# Altium schematic sheet L2_PCB.schdoc
size 309 x 197 mm
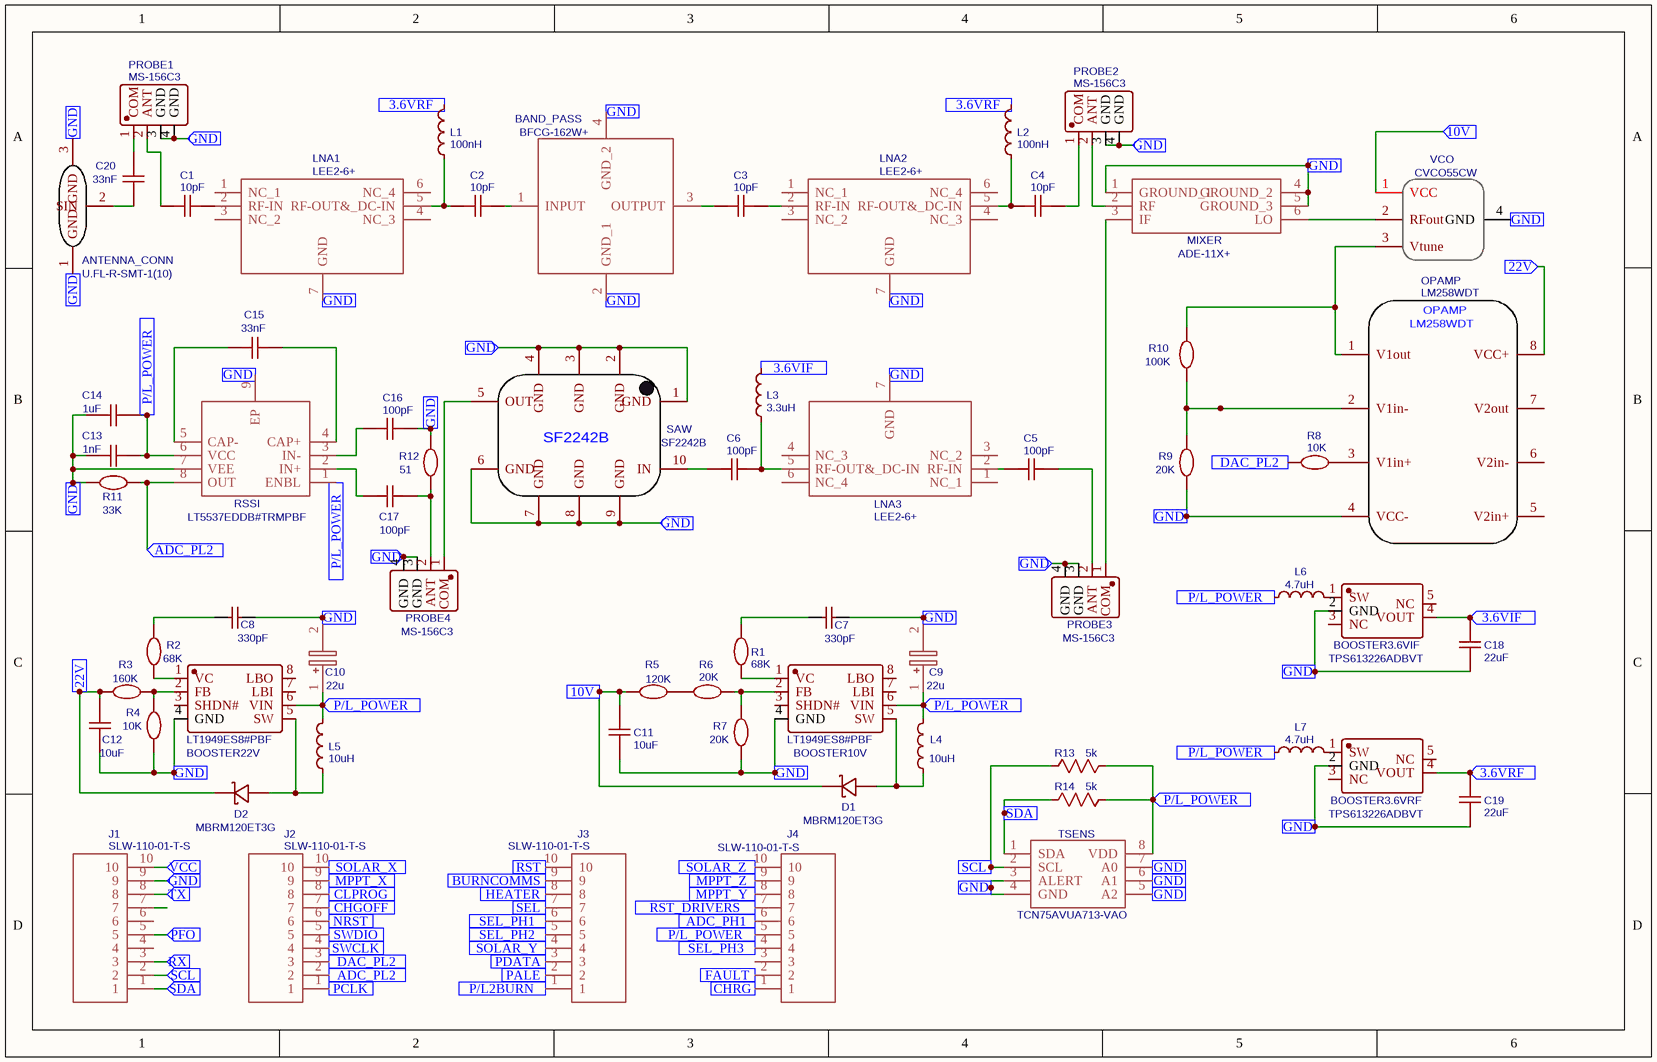
[diagram p0: L2_PCB.schdoc]

## Parts
ANTENNA_CONN  U.FL-R-SMT-1(10)  [ANT-SMD_UFL-R-SMT-1-10]
BAND_PASS  BFCG-162W+  [BFCG162W]
BOOSTER3.6VIF  TPS613226ADBVT  [SOT-23-5_L2.9-W1.6-P0.95-LS2.8-BR]
BOOSTER3.6VRF  TPS613226ADBVT  [SOT-23-5_L2.9-W1.6-P0.95-LS2.8-BR]
BOOSTER10V  LT1949ES8#PBF  [SO-8_L4.9-W3.9-P1.27-LS5.9-BL]
BOOSTER22V  LT1949ES8#PBF  [SO-8_L4.9-W3.9-P1.27-LS5.9-BL]
C1  10pF  [C0603]
C2  10pF  [C0603]
C3  10pF  [C0603]
C4  10pF  [C0603]
C5  100pF  [C0603]
C6  100pF  [C0603]
C7  330pF  [C0603]
C8  330pF  [C0603]
C9  22u  [CAPPM3216X180N]
C10  22u  [CAPPM3216X180N]
C11  10uF  [C0603]
C12  10uF  [C0603]
C13  1nF  [C0603]
C14  1uF  [C0603]
C15  33nF  [C0603]
C16  100pF  [C0603]
C17  100pF  [C0603]
C18  22uF  [C0603]
C19  22uF  [C0603]
C20  33nF  [C0603]
D1  MBRM120ET3G  [POWERMITE_L2.0-W1.9-LS3.8-RD]
D2  MBRM120ET3G  [POWERMITE_L2.0-W1.9-LS3.8-RD]
J1  SLW-110-01-T-S  [SLW-110-01-X-S]
J2  SLW-110-01-T-S  [SLW-110-01-X-S]
J3  SLW-110-01-T-S  [SLW-110-01-X-S]
J4  SLW-110-01-T-S  [SLW-110-01-X-S]
L1  100nH  [L0402]
L2  100nH  [L0402]
L3  3.3uH  [L0603]
L4  10uH  [L0603]
L5  10uH  [L0603]
L6  4.7uH  [L0805]
L7  4.7uH  [L0805]
LNA1  LEE2-6+  [SON65P200X200X105-7N]
LNA2  LEE2-6+  [SON65P200X200X105-7N]
LNA3  LEE2-6+  [SON65P200X200X105-7N]
MIXER  ADE-11X+  [SOTFL254P691X284-6N]
OPAMP  LM258WDT  [SO8]
PROBE1  MS-156C3  [IPEX-SMD_MS-156C3]
PROBE2  MS-156C3  [IPEX-SMD_MS-156C3]
PROBE3  MS-156C3  [IPEX-SMD_MS-156C3]
PROBE4  MS-156C3  [IPEX-SMD_MS-156C3]
R1  68K  [R0603]
R2  68K  [R0603]
R3  160K  [R0603]
R4  10K  [R0603]
R5  120K  [R0603]
R6  20K  [R0603]
R7  20K  [R0603]
R8  10K  [R0603]
R9  20K  [R0603]
R10  100K  [R0603]
R11  33K  [R0603]
R12  51  [R0603]
R13  5k  [R0805]
R14  5k  [R0805]
RSSI  LT5537EDDB#TRMPBF  [SON50P200X300X80-9N]
SAW  SF2242B  [SMP-03-10 5X7 MM]
TSENS  TCN75AVUA713-VAO  [SOP65P490X110-8N]
VCO  CVCO55CW  [CVCO55CW]

## Ports
3.6VIF (in), 3.6VRF (in), 10V (in), 22V (in), ADC_PH1 (in), ADC_PL2 (in), BURNCOMMS (in), CHGOFF (in), CHRG (in), CLPROG (in), DAC_PL2 (in), FAULT (in), GND (in), HEATER (in), MPPT_X (in), MPPT_Y (in), MPPT_Z (in), NRST (in), P/L2BURN (in), P/L_POWER (in), PALE (in), PCLK (in), PDATA (in), PFO (in), RST (in), RST_DRIVERS (in), RX (in), SCL (in), SDA (in), SEL (in), SEL_PH1 (in), SEL_PH2 (in), SEL_PH3 (in), SOLAR_X (in), SOLAR_Y (in), SOLAR_Z (in), SWCLK (in), SWDIO (in), TX (in), VCC (in)

## Nets
3.6VIF: BOOSTER3.6VIF.4(VOUT) C18.2 L3.2 ; port 3.6VIF
3.6VRF: BOOSTER3.6VRF.4(VOUT) C19.2 L1.2 L2.2 ; port 3.6VRF
10V: C11.2 D1.1(C) R5.1 VCO.1(VCC) ; port 10V
22V: C12.2 D2.1(C) OPAMP.8(VCC+) R3.1 ; port 22V
ADC_PH1: J4.6 ; port ADC_PH1
ADC_PL2: J2.2 R11.1 RSSI.8(OUT) ; port ADC_PL2
BURNCOMMS: J3.9 ; port BURNCOMMS
CHGOFF: J2.7 ; port CHGOFF
CHRG: J4.1 ; port CHRG
CLPROG: J2.8 ; port CLPROG
DAC_PL2: J2.3 R8.2 ; port DAC_PL2
FAULT: J4.2 ; port FAULT
GND: ANTENNA_CONN.1(GND) ANTENNA_CONN.3(GND) BAND_PASS.2(GND_1) BAND_PASS.4(GND_2) BOOSTER3.6VIF.2(GND) BOOSTER3.6VRF.2(GND) BOOSTER10V.4(GND) BOOSTER22V.4(GND) C7.2 C8.1 C9.2(-) C10.2(-) C11.1 C12.1 C13.2 C14.2 C16.2 C18.1 C19.1 J1.9 LNA1.7(GND) LNA2.7(GND) LNA3.7(GND) MIXER.1(GROUND_1) MIXER.4(GROUND_2) MIXER.5(GROUND_3) OPAMP.4(VCC-) PROBE1.3(GND) PROBE1.4(GND) PROBE2.3(GND) PROBE2.4(GND) PROBE3.3(GND) PROBE3.4(GND) PROBE4.3(GND) PROBE4.4(GND) R4.1 R7.1 R9.2 R11.2 R12.1 RSSI.7(VEE) RSSI.9(EP) SAW.1(GND) SAW.2(GND) SAW.3(GND) SAW.4(GND) SAW.6(GND) SAW.7(GND) SAW.8(GND) SAW.9(GND) TSENS.3(ALERT) TSENS.4(GND) TSENS.5(A2) TSENS.6(A1) TSENS.7(A0) VCO.4(GND) ; port GND
HEATER: J3.8 ; port HEATER
MPPT_X: J2.9 ; port MPPT_X
MPPT_Y: J4.8 ; port MPPT_Y
MPPT_Z: J4.9 ; port MPPT_Z
NRST: J2.6 ; port NRST
P/L2BURN: J3.1 ; port P/L2BURN
P/L_POWER: BOOSTER10V.6(VIN) BOOSTER22V.6(VIN) C9.1(+) C10.1(+) C13.1 C14.1 J4.5 L4.2 L5.2 L6.1 L7.1 R13.2 R14.2 RSSI.1(ENBL) RSSI.6(VCC) TSENS.8(VDD) ; port P/L_POWER
PALE: J3.2 ; port PALE
PCLK: J2.1 ; port PCLK
PDATA: J3.3 ; port PDATA
PFO: J1.5 ; port PFO
RST: J3.10 ; port RST
RST_DRIVERS: J4.7 ; port RST_DRIVERS
RX: J1.3 ; port RX
SCL: J1.2 R13.1 TSENS.2(SCL) ; port SCL
SDA: J1.1 R14.1 TSENS.1(SDA) ; port SDA
SEL: J3.7 ; port SEL
SEL_PH1: J3.6 ; port SEL_PH1
SEL_PH2: J3.5 ; port SEL_PH2
SEL_PH3: J4.4 ; port SEL_PH3
SOLAR_X: J2.10 ; port SOLAR_X
SOLAR_Y: J3.4 ; port SOLAR_Y
SOLAR_Z: J4.10 ; port SOLAR_Z
SWCLK: J2.4 ; port SWCLK
SWDIO: J2.5 ; port SWDIO
TX: J1.8 ; port TX
VCC: J1.10 ; port VCC
NetANTENNA_CONN_2: ANTENNA_CONN.2(SIN) C20.2
NetBAND_PASS_1: BAND_PASS.1(INPUT) C2.2
NetBAND_PASS_3: BAND_PASS.3(OUTPUT) C3.1
NetBOOSTER3.6VIF_1: BOOSTER3.6VIF.1(SW) L6.2
NetBOOSTER3.6VRF_1: BOOSTER3.6VRF.1(SW) L7.2
NetBOOSTER10V_1: BOOSTER10V.1(VC) R1.1
NetBOOSTER10V_2: BOOSTER10V.2(FB) R6.2 R7.2
NetBOOSTER10V_5: BOOSTER10V.5(SW) D1.2(A) L4.1
NetBOOSTER22V_1: BOOSTER22V.1(VC) R2.2
NetBOOSTER22V_2: BOOSTER22V.2(FB) R3.2 R4.2
NetBOOSTER22V_5: BOOSTER22V.5(SW) D2.2(A) L5.1
NetC1_1: C1.1 PROBE1.2(ANT)
NetC1_2: C1.2 LNA1.2(RF-IN)
NetC2_1: C2.1 L1.1 LNA1.5(RF-OUT&_DC-IN)
NetC3_2: C3.2 LNA2.2(RF-IN)
NetC4_1: C4.1 L2.1 LNA2.5(RF-OUT&_DC-IN)
NetC4_2: C4.2 PROBE2.1(COM)
NetC5_1: C5.1 LNA3.2(RF-IN)
NetC5_2: C5.2 PROBE3.2(ANT)
NetC6_1: C6.1 SAW.10(IN)
NetC6_2: C6.2 L3.1 LNA3.5(RF-OUT&_DC-IN)
NetC7_1: C7.1 R1.2
NetC8_2: C8.2 R2.1
NetC15_1: C15.1 RSSI.4(CAP+)
NetC15_2: C15.2 RSSI.5(CAP-)
NetC16_1: C16.1 RSSI.3(IN-)
NetC17_1: C17.1 RSSI.2(IN+)
NetC17_2: C17.2 PROBE4.2(ANT) R12.2
NetC20_1: C20.1 PROBE1.1(COM)
NetMIXER_2: MIXER.2(RF) PROBE2.2(ANT)
NetMIXER_3: MIXER.3(IF) PROBE3.1(COM)
NetMIXER_6: MIXER.6(LO) VCO.2(RFout)
NetOPAMP_1: OPAMP.1(V1out) R10.2 VCO.3(Vtune)
NetOPAMP_2: OPAMP.2(V1in-) R9.1 R10.1
NetOPAMP_3: OPAMP.3(V1in+) R8.1
NetPROBE4_1: PROBE4.1(COM) SAW.5(OUT)
NetR5_2: R5.2 R6.1

Not connected (* = marked no-connect by the designer): BOOSTER3.6VIF 3(NC) 5(NC); BOOSTER3.6VRF 3(NC) 5(NC); BOOSTER10V 3(SHDN#) 7(LBI) 8(LBO); BOOSTER22V 3(SHDN#) 7(LBI) 8(LBO); J1 4 6 7; J4 3; LNA1 1(NC_1) 3(NC_2) 4(NC_3) 6(NC_4); LNA2 1(NC_1) 3(NC_2) 4(NC_3) 6(NC_4); LNA3 1(NC_1) 3(NC_2) 4(NC_3) 6(NC_4); OPAMP 5(V2in+) 6(V2in-) 7(V2out)

## Library data of the parts
ANTENNA_CONN = U.FL-R-SMT-1(10): BOM_Manufacturer: HRS; BOM_Supplier: LCSC; BOM_Manufacturer Part: U.FL-R-SMT-1(10); BOM_Supplier Part: C88373; JLCPCB Part Class: Extended Part; BOM_JLCPCB Part Class: Extended Part; spicePre: J; spiceSymbolName: U.FL-R-SMT-1(10)
BAND_PASS = BFCG-162W+: Contributor: roger.bock; spicePre: F; spiceSymbolName: BFCG-162W+
BOOSTER3.6VIF BOOSTER3.6VRF = TPS613226ADBVT: BOM_Manufacturer: TI(德州仪器); Contributor: LCSC; BOM_Supplier: LCSC; BOM_Supplier Part: C2070790; BOM_Manufacturer Part: TPS613226ADBVT; spicePre: U; spiceSymbolName: TPS613226ADBVT
BOOSTER10V BOOSTER22V = LT1949ES8#PBF: BOM_Manufacturer: Analog Devices; Contributor: LCSC; BOM_Supplier: LCSC; BOM_Supplier Part: C665614; BOM_Manufacturer Part: LT1949ES8#PBF; BOM_JLCPCB Part Class: Extended Part; spicePre: U; spiceSymbolName: LT1949ES8#PBF
C1-C4 = 10pF: BOM_Manufacturer: YAGEO; BOM_Manufacturer Part: CC0603JRNPO0BN100; nameAlias: Capacitance; Contributor: LCSC; BOM_Supplier: LCSC; BOM_Supplier Part: C576799; BOM_JLCPCB Part Class: Extended Part; spicePre: C; spiceSymbolName: CC0603JRNPO0BN100
C5 C6 C16 C17 = 100pF: BOM_Manufacturer: YAGEO; BOM_Manufacturer Part: CC0603JRNPO0BN100; nameAlias: Capacitance; Contributor: LCSC; BOM_Supplier: LCSC; BOM_Supplier Part: C576799; BOM_JLCPCB Part Class: Extended Part; spicePre: C; spiceSymbolName: CC0603JRNPO0BN100
C7 C8 = 330pF: BOM_Manufacturer: MuRata; BOM_Manufacturer Part: GRM188R71H331KA01D; nameAlias: Capacitance; BOM_Supplier: LCSC; BOM_Supplier Part: C97894; BOM_JLCPCB Part Class: Extended Part; spicePre: C; spiceSymbolName: GRM188R71H331KA01D
C9 C10 = 22u: Contributor: Blothr; spicePre: C; spiceSymbolName: TAJA226M010RNJ
C11 C12 = 10uF: BOM_Manufacturer: Murata Electronics; BOM_Manufacturer Part: GRM188C80J106MA73D; nameAlias: Capacitance; Contributor: LCSC; BOM_Supplier: LCSC; BOM_Supplier Part: C469533; BOM_JLCPCB Part Class: Extended Part; spicePre: C; spiceSymbolName: GRM188C80J106MA73D
C13 = 1nF: BOM_Manufacturer: Murata Electronics; BOM_Manufacturer Part: GRM188C80J106MA73D; nameAlias: Capacitance; Contributor: LCSC; BOM_Supplier: LCSC; BOM_Supplier Part: C469533; BOM_JLCPCB Part Class: Extended Part; spicePre: C; spiceSymbolName: GRM188C80J106MA73D
C14 = 1uF: BOM_Manufacturer: Murata Electronics; BOM_Manufacturer Part: GRM188C80J106MA73D; nameAlias: Capacitance; Contributor: LCSC; BOM_Supplier: LCSC; BOM_Supplier Part: C469533; BOM_JLCPCB Part Class: Extended Part; spicePre: C; spiceSymbolName: GRM188C80J106MA73D
C15 C20 = 33nF: BOM_Manufacturer: Murata Electronics; BOM_Manufacturer Part: GRM188C80J106MA73D; nameAlias: Capacitance; Contributor: LCSC; BOM_Supplier: LCSC; BOM_Supplier Part: C469533; BOM_JLCPCB Part Class: Extended Part; spicePre: C; spiceSymbolName: GRM188C80J106MA73D
C18 C19 = 22uF: BOM_Manufacturer: Taiyo Yuden; BOM_Manufacturer Part: JMK107BJ226MA-TD; nameAlias: Capacitance; Contributor: LCSC; BOM_Supplier: LCSC; BOM_Supplier Part: C386017; BOM_JLCPCB Part Class: Extended Part; spicePre: C; spiceSymbolName: JMK107BJ226MA-TD
D1 D2 = MBRM120ET3G: BOM_Manufacturer: ON; Contributor: LCSC; BOM_Supplier Part: C154780; BOM_Supplier: LCSC; BOM_Manufacturer Part: MBRM120ET3G; BOM_JLCPCB Part Class: Extended Part; spicePre: D; spiceSymbolName: MBRM120ET3G
J1-J4 = SLW-110-01-T-S: Contributor: Hans Stahl; spicePre: J; spiceSymbolName: SLW-110-01-T-S
L1 L2 = 100nH: BOM_Manufacturer: Sunlord; BOM_Manufacturer Part: SDFL1005LR10KTF; nameAlias: Inductance; Contributor: LCSC; BOM_Supplier: LCSC; BOM_Supplier Part: C370259; BOM_JLCPCB Part Class: Extended Part; spicePre: L; spiceSymbolName: SDFL1005LR10KTF
L3 = 3.3uH: BOM_Manufacturer: Yanchuang; BOM_Manufacturer Part: SCMI160808U1R0KT; nameAlias: Inductance; Contributor: LCSC; BOM_Supplier: LCSC; BOM_Supplier Part: C479880; BOM_JLCPCB Part Class: Extended Part; spicePre: L; spiceSymbolName: SCMI160808U1R0KT
L4 L5 = 10uH: BOM_Manufacturer: Murata Electronics; BOM_Manufacturer Part: LQM18PN2R2NC0L; nameAlias: Inductance; Contributor: LCSC; BOM_Supplier: LCSC; BOM_Supplier Part: C162580; BOM_JLCPCB Part Class: Extended Part; spicePre: L; spiceSymbolName: LQM18PN2R2NC0L
L6 L7 = 4.7uH: BOM_Manufacturer: Taiyo Yuden; BOM_Manufacturer Part: CBC2012T4R7M; nameAlias: Inductance; Contributor: LCSC; BOM_Supplier: LCSC; BOM_Supplier Part: C92978; BOM_JLCPCB Part Class: Extended Part; spicePre: L; spiceSymbolName: CBC2012T4R7M
LNA1-LNA3 = LEE2-6+: Contributor: Blothr; spicePre: I; spiceSymbolName: LEE2-6+
MIXER = ADE-11X+: Contributor: George-vlad Enache; spicePre: I; spiceSymbolName: ADE-11X+
OPAMP = LM258WDT: BOM_Manufacturer: STMicroelectronics; Contributor: Blothr; BOM_Manufacturer Part: LM258WDT; BOM_Supplier Part: 511-LM258WDT; BOM_Supplier: Mouser; link: https://www.mouser.es/ProductDetail/STMicroelectronics/LM258WDT?qs=5J552fbOmopVuM7p9O0zDw%3D%3D; spicePre: U; spiceSymbolName: LM258WDT
PROBE1-PROBE4 = MS-156C3: BOM_Manufacturer: HRS(广濑); Contributor: LCSC; BOM_Supplier: LCSC; BOM_Supplier Part: C424673; BOM_Manufacturer Part: MS-156C3; BOM_JLCPCB Part Class: Extended Part; spicePre: R; spiceSymbolName: MS-156C3
R1 R2 = 68K: BOM_Manufacturer: Walsin Tech Corp; BOM_Manufacturer Part: WR06X243 JTL; nameAlias: Resistance (Ohms); Contributor: LCSC; BOM_Supplier: LCSC; BOM_Supplier Part: C384257; BOM_JLCPCB Part Class: Extended Part; spicePre: R; spiceSymbolName: WR06X243 JTL
R3 = 160K: BOM_Manufacturer: Walsin Tech Corp; BOM_Manufacturer Part: WR06X243 JTL; nameAlias: Resistance (Ohms); Contributor: LCSC; BOM_Supplier: LCSC; BOM_Supplier Part: C384257; BOM_JLCPCB Part Class: Extended Part; spicePre: R; spiceSymbolName: WR06X243 JTL
R4 R8 = 10K: BOM_Manufacturer: Walsin Tech Corp; BOM_Manufacturer Part: WR06X243 JTL; nameAlias: Resistance (Ohms); Contributor: LCSC; BOM_Supplier: LCSC; BOM_Supplier Part: C384257; BOM_JLCPCB Part Class: Extended Part; spicePre: R; spiceSymbolName: WR06X243 JTL
R5 = 120K: BOM_Manufacturer: Walsin Tech Corp; BOM_Manufacturer Part: WR06X243 JTL; nameAlias: Resistance (Ohms); Contributor: LCSC; BOM_Supplier: LCSC; BOM_Supplier Part: C384257; BOM_JLCPCB Part Class: Extended Part; spicePre: R; spiceSymbolName: WR06X243 JTL
R6 R7 R9 = 20K: BOM_Manufacturer: Walsin Tech Corp; BOM_Manufacturer Part: WR06X243 JTL; nameAlias: Resistance (Ohms); Contributor: LCSC; BOM_Supplier: LCSC; BOM_Supplier Part: C384257; BOM_JLCPCB Part Class: Extended Part; spicePre: R; spiceSymbolName: WR06X243 JTL
R10 = 100K: BOM_Manufacturer: Walsin Tech Corp; BOM_Manufacturer Part: WR06X243 JTL; nameAlias: Resistance (Ohms); Contributor: LCSC; BOM_Supplier: LCSC; BOM_Supplier Part: C384257; BOM_JLCPCB Part Class: Extended Part; spicePre: R; spiceSymbolName: WR06X243 JTL
R11 = 33K: BOM_Manufacturer: Walsin Tech Corp; BOM_Manufacturer Part: WR06X243 JTL; nameAlias: Resistance (Ohms); Contributor: LCSC; BOM_Supplier: LCSC; BOM_Supplier Part: C384257; BOM_JLCPCB Part Class: Extended Part; spicePre: R; spiceSymbolName: WR06X243 JTL
R12 = 51: BOM_Manufacturer: Walsin Tech Corp; BOM_Manufacturer Part: WR06X243 JTL; nameAlias: Resistance (Ohms); Contributor: LCSC; BOM_Supplier: LCSC; BOM_Supplier Part: C384257; BOM_JLCPCB Part Class: Extended Part; spicePre: R; spiceSymbolName: WR06X243 JTL
R13 R14 = 5k: BOM_Manufacturer Part: CRCW08055K00JNTA; BOM_Manufacturer: Vishay / Dale; nameAlias: Value(Ω); Contributor: LCEDA_Lib; BOM_Supplier Part: 71-CRCW0805J-5K; BOM_Supplier: Mouser; spicePre: R; spiceSymbolName: R_0603_US; BOM_Link: https://www.mouser.es/ProductDetail/Vishay-Dale/CRCW08055K00JNTA?qs=%2Fha2pyFadui6t5gBae62ocFJ46SNue422n5luvT1xmc7fnXInubqKA%3D%3D
RSSI = LT5537EDDB#TRMPBF: Contributor: Blothr; spicePre: I; spiceSymbolName: LT5537EDDB#TRMPBF
SAW = SF2242B: BOM_Manufacturer: RFMi; Contributor: Blothr; BOM_Manufacturer Part: SF2242B; BOM_Supplier: Mouser; BOM_Supplier Part: 198-SF2242B; link: https://www.mouser.es/ProductDetail/RFMi/SF2242B?qs=zW32dvEIR3s7z3tRlXhObQ%3D%3D; spicePre: U; spiceSymbolName: SF2242B
VCO = CVCO55CW: BOM_Manufacturer: Crystek; Contributor: ExHep; BOM_Supplier: Mouser; spicePre: O; spiceSymbolName: CVCO55CW
TSENS = TCN75AVUA713-VAO: spicePre: I; spiceSymbolName: TCN75AVUA713-VAO